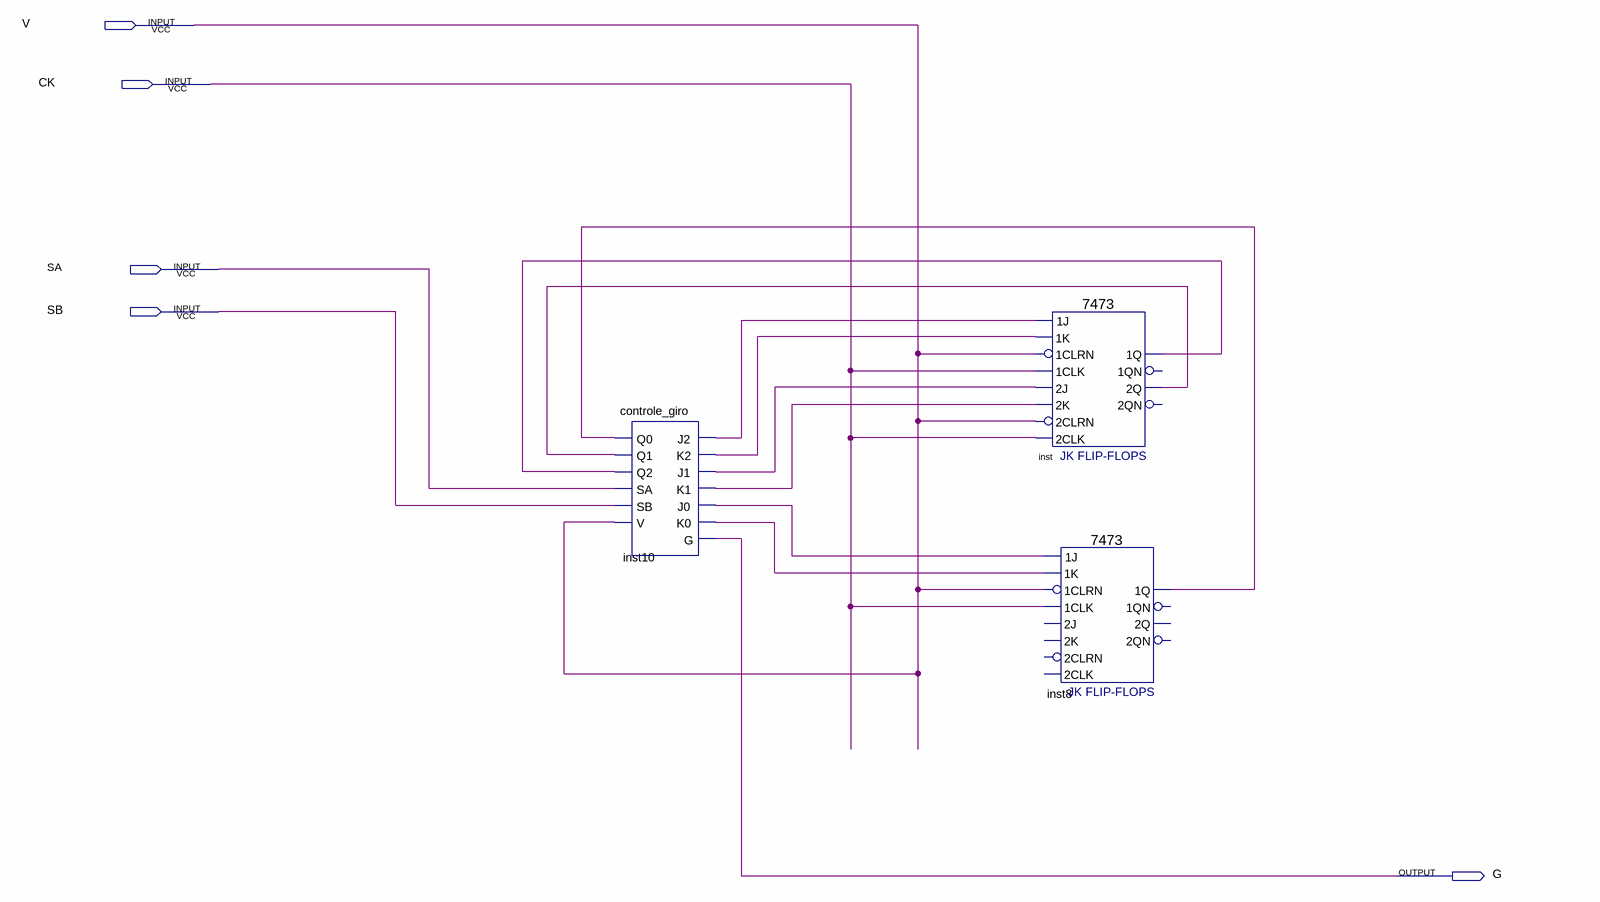
[diagram p0: schematic sheet]
// Quartus schematic conta_giro.bdf as structural Verilog: 3 symbols, 5 pins
module conta_giro (
  input  V,
  input  CK,
  input  SA,
  input  SB,
  output G
);

  wire inst8_1q, inst10_j0, inst10_j1, inst10_j2, inst10_k0, inst10_k1, inst10_k2, inst_1q, inst_2q;

  controle_giro inst10 (
    .Q0(inst8_1q), .Q1(inst_2q), .Q2(inst_1q), .SA(SA), .SB(SB), .V(V), .J2(inst10_j2), .K2(inst10_k2),
    .J1(inst10_j1), .K1(inst10_k1), .J0(inst10_j0), .K0(inst10_k0), .G(G));
  \7473  inst (
    .\1J (inst10_j2), .\1CLRN (V), .\1K (inst10_k2), .\1CLK (CK), .\2J (inst10_j1), .\2CLK (CK), .\2CLRN (V),
    .\2K (inst10_k1), .\2Q (inst_2q), .\1Q (inst_1q));  // open: 1QN, 2QN
  \7473  inst8 (
    .\1J (inst10_j0), .\1CLRN (V), .\1K (inst10_k0), .\1CLK (CK), .\1Q (inst8_1q));  // open: 2J, 2CLK, 2CLRN, 2K, 1QN, 2Q, 2QN
endmodule
